# EAGLE design Blocky_Mini_Ultra (EAGLE 9.1.3)
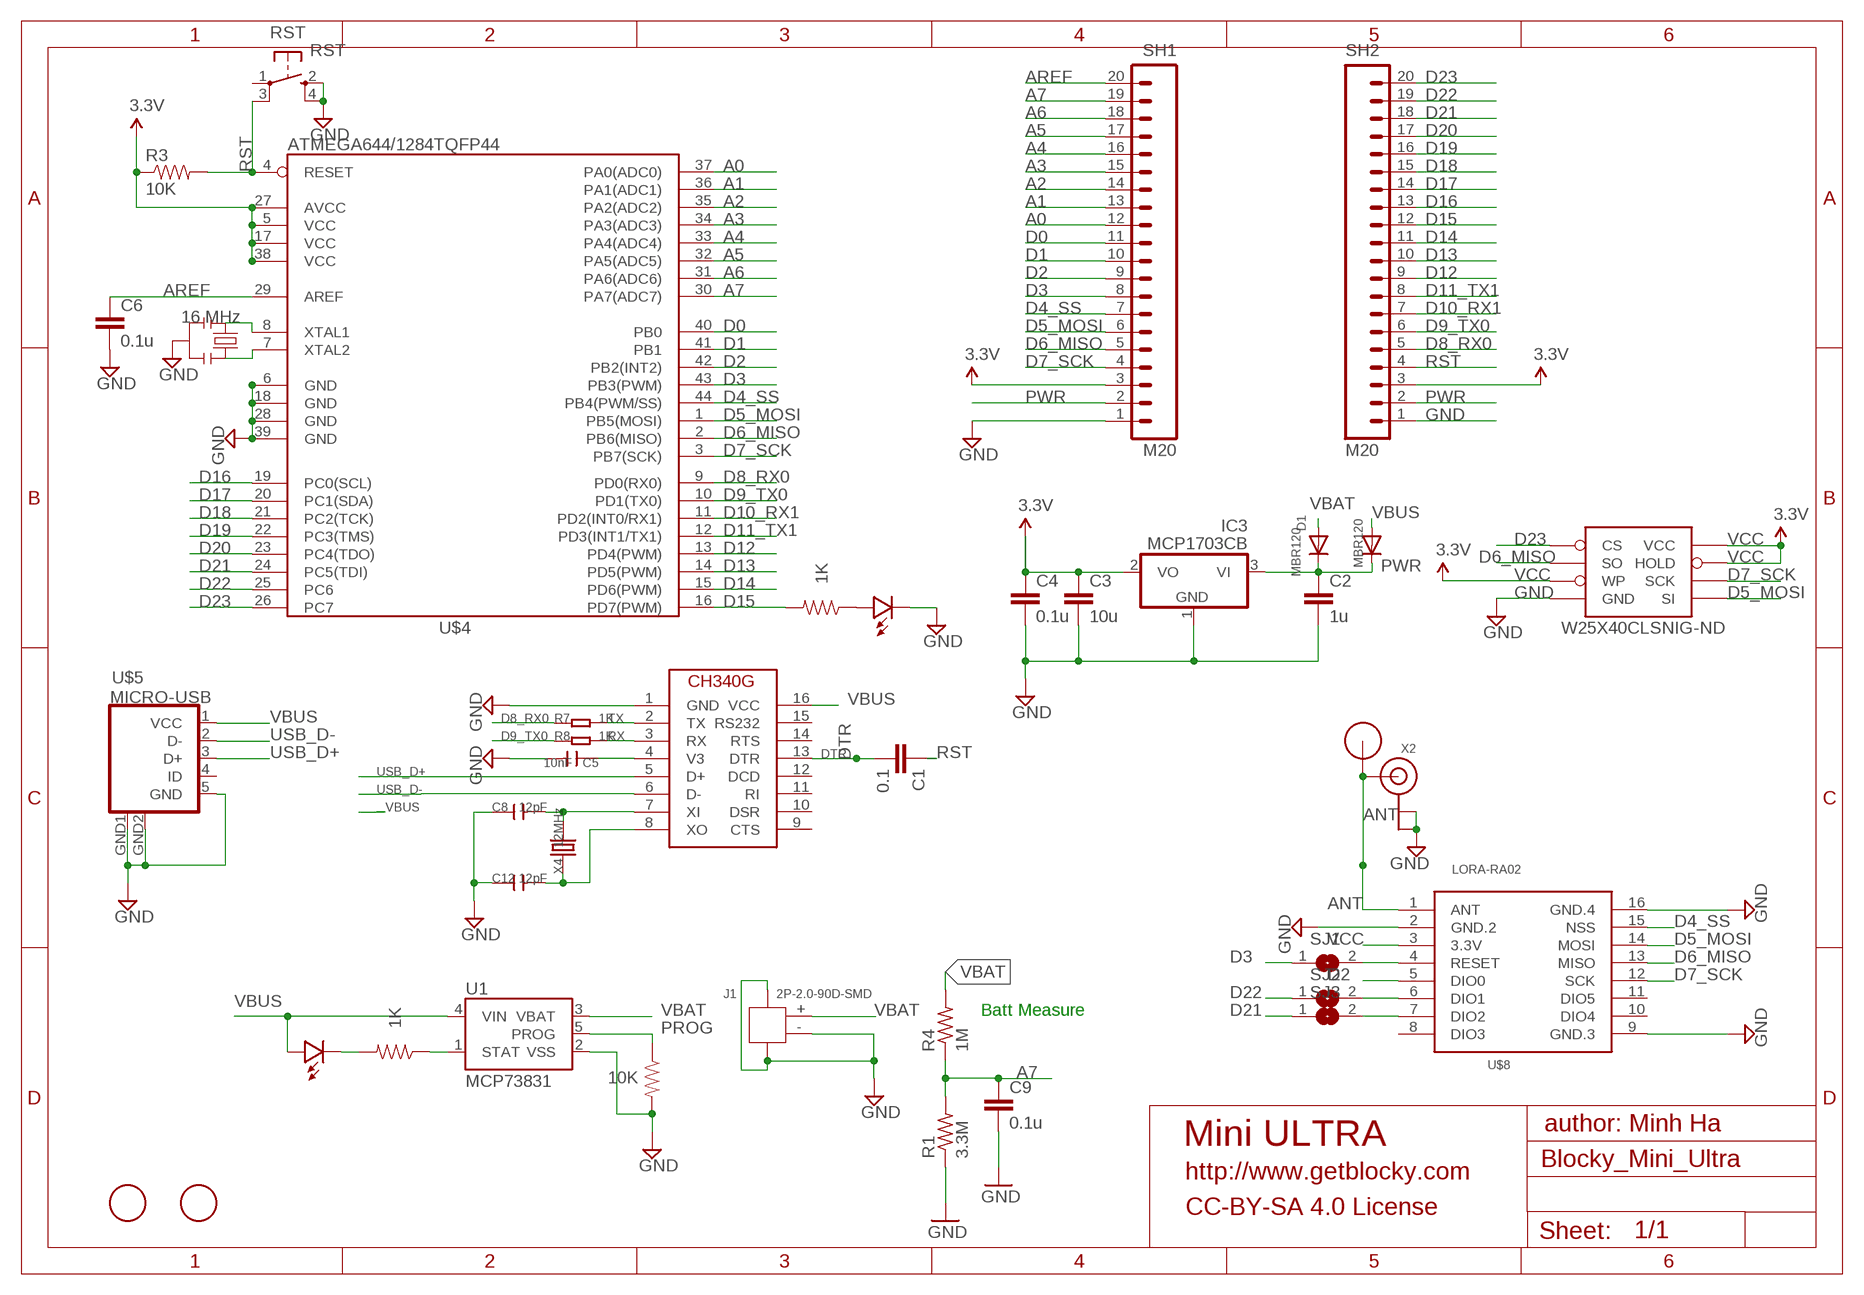
[diagram p0: schematic, sheet 1]

## Parts
C1  0.1  CAP0603-CAP  [0603-CAP]
C2  1u  CAP0603-CAP  [0603-CAP]
C3  10u  CAP0603-CAP  [0603-CAP]
C4  0.1u  CAP0603-CAP  [0603-CAP]
C5  10nF  C-0603  [C0603]
C6  0.1u  CAP0603-CAP  [0603-CAP]
C8  12pF  C-0603  [C0603]
C9  0.1u  CAP0603-CAP  [0603-CAP]
C12  12pF  C-0603  [C0603]
CHG  RED  LED0603  [0603-LED]
D1  MBR120  DIODESOD-123  [SOD-123]
IC3  MCP1703CB  [SOT23]
J1  2P-2.0-90D-SMD  CONN-HEADER-SMD-PH-SIDE-(2P-2.0MM)  [HW2-SMD-2.0-90D]
MBR0001  MBR120  DIODESOD-123  [SOD-123]
R1  3.3M  R-US_R0603  [R0603]
R2  1K  RESISTOR0603-RES  [0603-RES]
R3  10K  RESISTOR0603-RES  [0603-RES]
R4  1M  R-US_R0603  [R0603]
R5  1K  RESISTOR0603-RES  [0603-RES]
R6  10K  RESISTOR0603-RES  [0603-RES]
R7  1K  R-0603  [R0603]
R8  1K  R-0603  [R0603]
RST  RST  SPST_TACT-KMR2  [KMR2]
SH1  M20  [1X20]
SH2  M20  [1X20]
SJ1  SOLDERJUMPER  [SOLDERJUMPER_ARROW_NOPASTE]
SJ2  SOLDERJUMPER  [SOLDERJUMPER_ARROW_NOPASTE]
SJ3  SOLDERJUMPER  [SOLDERJUMPER_ARROW_NOPASTE]
U1  MCP73831  [SOT23-5]
U$1  RFM12B_ANTENNA  [RFM12B-ANTENNA]
U$2  FIDUCIAL  [FIDUCIAL_1MM]
U$4  ATMEGA644/1284TQFP44  [TQFP44]
U$5  MICRO-USB  [MICRO-USB]
U$6  LED0603  [0603-LED]
U$7  FIDUCIAL  [FIDUCIAL_1MM]
U$8  LORA-RA02  LORA-RA-02-433MHZ  [LORA-RA2-SMD]
U$9  CH340G  [SOIC16]
W25X40CLSNIG-ND  AT25F512BWIDE_5.3MM  [SO08WIDE]
X1  16 MHz  RESONATORSMD  [RESONATOR-SMD]
X2  ANTENNA_U.FL  [U.FL]
X4  12MHz  CRYSTAL'5032'  [2P-SMD-5X3.2]

## Nets
A0: SH1.12 U$4.37(PA0(ADC0))
A1: SH1.13 U$4.36(PA1(ADC1))
A2: SH1.14 U$4.35(PA2(ADC2))
A3: SH1.15 U$4.34(PA3(ADC3))
A4: SH1.16 U$4.33(PA4(ADC4))
A5: SH1.17 U$4.32(PA5(ADC5))
A6: SH1.18 U$4.31(PA6(ADC6))
A7: C9.1 R1.2 R4.1 SH1.19 U$4.30(PA7(ADC7))
ANT: U$1.P$1 U$8.1(ANT) X2.3(SIGNAL)
AREF: C6.1 SH1.20 U$4.29(AREF)
D0: SH1.11 U$4.40(PB0)
D1: SH1.10 U$4.41(PB1)
D2: SH1.9 U$4.42(PB2(INT2)) U$8.5(DIO0)
D3: SH1.8 SJ1.1 U$4.43(PB3(PWM))
D4_SS: SH1.7 U$4.44(PB4(PWM/SS)) U$8.15(NSS)
D5_MOSI: SH1.6 U$4.1(PB5(MOSI)) U$8.14(MOSI) W25X40CLSNIG-ND.5(SI)
D6_MISO: SH1.5 U$4.2(PB6(MISO)) U$8.13(MISO) W25X40CLSNIG-ND.2(SO)
D7_SCK: SH1.4 U$4.3(PB7(SCK)) U$8.12(SCK) W25X40CLSNIG-ND.6(SCK)
D8_RX0: R7.1 SH2.5 U$4.9(PD0(RX0))
D9_TX0: R8.1 SH2.6 U$4.10(PD1(TX0))
D10_RX1: SH2.7 U$4.11(PD2(INT0/RX1))
D11_TX1: SH2.8 U$4.12(PD3(INT1/TX1))
D12: SH2.9 U$4.13(PD4(PWM))
D13: SH2.10 U$4.14(PD5(PWM))
D14: SH2.11 U$4.15(PD6(PWM))
D15: R2.2 SH2.12 U$4.16(PD7(PWM))
D16: SH2.13 U$4.19(PC0(SCL))
D17: SH2.14 U$4.20(PC1(SDA))
D18: SH2.15 U$4.21(PC2(TCK))
D19: SH2.16 U$4.22(PC3(TMS))
D20: SH2.17 U$4.23(PC4(TDO))
D21: SH2.18 SJ3.1 U$4.24(PC5(TDI))
D22: SH2.19 SJ2.1 U$4.25(PC6)
D23: SH2.20 U$4.26(PC7) W25X40CLSNIG-ND.1(CS)
DIO1: SJ2.2 U$8.6(DIO1)
DIO2: SJ3.2 U$8.7(DIO2)
DTR: C1.2 U$9.13(DTR)
GND [power]: C2.2 C3.2 C4.2 C5.2 C6.2 C8.1 C9.2 C12.1 IC3.1(GND) J1.3 J1.4 J1.- R1.1 R6.2 RST.2(S) RST.4(S1) SH1.1 SH2.1 U1.2(VSS) U$4.6(GND) U$4.18(GND) U$4.28(GND) U$4.39(GND) U$5.5(GND) U$5.GND1(GND) U$5.GND2(GND) U$6.MINUS U$8.2(GND.2) U$8.9(GND.3) U$8.16(GND.4) U$9.1(GND) W25X40CLSNIG-ND.4(GND) X1.2 X2.1(GND) X2.2(GND)
N$1: U$4.8(XTAL1) X1.1
N$2: R2.1 U$6.PLUS
N$4: U$4.7(XTAL2) X1.3
N$9: CHG.MINUS R5.2
PROG: R6.1 U1.5(PROG)
PWR [power]: C2.1 D1.C IC3.3(VI) MBR0001.C SH1.2 SH2.2
RA02_RST: SJ1.2 U$8.4(RESET)
RST: C1.1 R3.2 RST.3(P1) SH2.4 U$4.4(RESET)
RX: R8.2 U$9.3(RX)
STAT: R5.1 U1.1(STAT)
TX: R7.2 U$9.2(TX)
USB_D+: U$5.3(D+) U$9.5(D+)
USB_D-: U$5.2(D-) U$9.6(D-)
V3: C5.1 U$9.4(V3)
VBAT: D1.A J1.+ R4.2 U1.3(VBAT)
VBUS: CHG.PLUS MBR0001.A U1.4(VIN) U$5.1(VCC) U$9.16(VCC)
VCC: C3.1 C4.1 IC3.2(VO) R3.1 SH1.3 SH2.3 U$4.5(VCC) U$4.17(VCC) U$4.27(AVCC) U$4.38(VCC) U$8.3(3.3V) W25X40CLSNIG-ND.3(WP) W25X40CLSNIG-ND.7(HOLD) W25X40CLSNIG-ND.8(VCC) ; supply symbol labelled 3.3V
XI: C8.2 U$9.7(XI) X4.2
XO: C12.2 U$9.8(XO) X4.1
Unconnected: RST.1(P) U$5.4(ID) U$8.8(DIO3) U$8.10(DIO4) U$8.11(DIO5) U$9.9(CTS) U$9.10(DSR) U$9.11(RI) U$9.12(DCD) U$9.14(RTS) U$9.15(RS232)

## Notes on the sheet
- Batt Measure
- author: Minh Ha
- Mini ULTRA
- http://www.getblocky.com
- CC-BY-SA 4.0 License

## Library data of the parts
C1-C4 C6 C9 = LowPowerLab:CAP: Capacitor Standard 0603 ceramic capacitor, and 0.1" leaded capacitor.
C5 C8 C12 = Discrete:C*: Ceramic Capacitors
CHG U$6 = LowPowerLab:LED
D1 MBR0001 = adafruit:DIODE: Diode SMADIODE - SMA Surface Mount Package 20V 1A Schottky Diode Digikey: 641-1014-6-ND DO-1N4148 - Through Hole Small Current Diode SOD-123 20V 1 A (.5mV Vf) Schottky Diode - Digikey: MBRX120TPMSCT-ND SOD-323 10V 570mA (.38mV Vf, 3ns) Schottky Diode - Digikey: ZLLS410CT-ND SOD-523 30V 30mA Schottky Diode (RB751S-40TE61) - Digikey: RB751S-40TE61CT-ND SOT23-R/W - SOT23 Package (R = Solder Paste/Reflow Ovens, W = Hand-Soldering) BAT54Film 40V 300mA - Digikey: 497-7162-1-ND
IC3 = linear:MCP1703: 250 mA, 16V, Low Quiescent Current LDO Regulator Source: http://ww1.microchip.com/downloads/en/DeviceDoc/22049b.pdf
J1 = Seeed-Connector:CONN-HEADER-SMD-PH-SIDE-(2P-2.0MM): 320110026
R1 R4 = adafruit:R-US_: RESISTOR, American symbol
R2 R3 R5 R6 = LowPowerLab:RESISTOR: Resistor Basic schematic elements and footprints for 0603, 1206, and PTH resistors.
R7 R8 = Discrete:R*
RST = adafruit:SPST_TACT: SMT 6mm switch, EVQQ2 series http://www.ladyada.net/library/eagle
SH1 SH2 = SparkFun-Connectors:M20: 1x20 .1" header This is just like the LOCK variant in that the holes are staggared by 5 mil, but except for the last two holes. They are not altered from the "standard" footprint layout. This is used for a special purpose on the layout of our Graphic LCD Backpack. Make sure you want to use this device before selecting it for you project!
SJ1-SJ3 = microbuilder:SOLDERJUMPER: SMD Solder JUMPER Solder the two pads together to create a connection, or remove the solder to break it. REFLOW - Use this footprint for solder paste and reflow ovens. WAVE - Use this footprint for hand-soldering (larger pads). CLOSED - Has a trace between the two pads to ensure it is closed by default. The trace needs to be cut to disable the jumper, and can be closed again by creating a solder bridge between the two pads.; BOM: EXCLUDE
U1 = SparkFun-PowerIC:MCP73831: Miniature single cell, fully integrated Li-Ion, Li-polymer charge management controller http://ww1.microchip.com/downloads/en/DeviceDoc/20001984g.pdf IC-09995; PROD_ID: IC-09995
U$1 = LowPowerLab:RFM12B_ANTENNA
U$2 U$7 = adafruit:FIDUCIAL: For use by pick and place machines to calibrate the vision/machine, 1mm By microbuilder.eu
U$4 = LowPowerLab:ATMEGA644/1284
U$5 = My-Eagle-Lib:MICRO-USB: Micro USB B connector
U$8 = LikeCircuit:LORA-RA-02-433MHZ: 433 MHz Lora Ra-02 Radio Transceiver Module based on SX1276 chip. Visit our more eagle PCB <https://www.likecircuit.com/>
U$9 = My-Eagle-Lib:CH340G
W25X40CLSNIG-ND = LowPowerLab:AT25F512B: 4-Mbit SPI flash memory
X1 = SparkFun:RESONATOR: Resonator Small SMD resonator. This is the itty bitty 10/20MHz resonators with built in caps. CSTCE10M0G55 and CSTCE20M0V53. Footprint has been reviewed closely but hasn't been tested yet.
X2 = adafruit:ANTENNA_U.FL: U.FL Antenna Connector
X4 = Discrete:CRYSTAL*: CRYSTAL

## Net classes
1 power: width 0.381 mm, clearance 0.254 mm
3 usbvcc: width 0.203 mm, drill 0.305 mm, clearance 0.203 mm

## Board
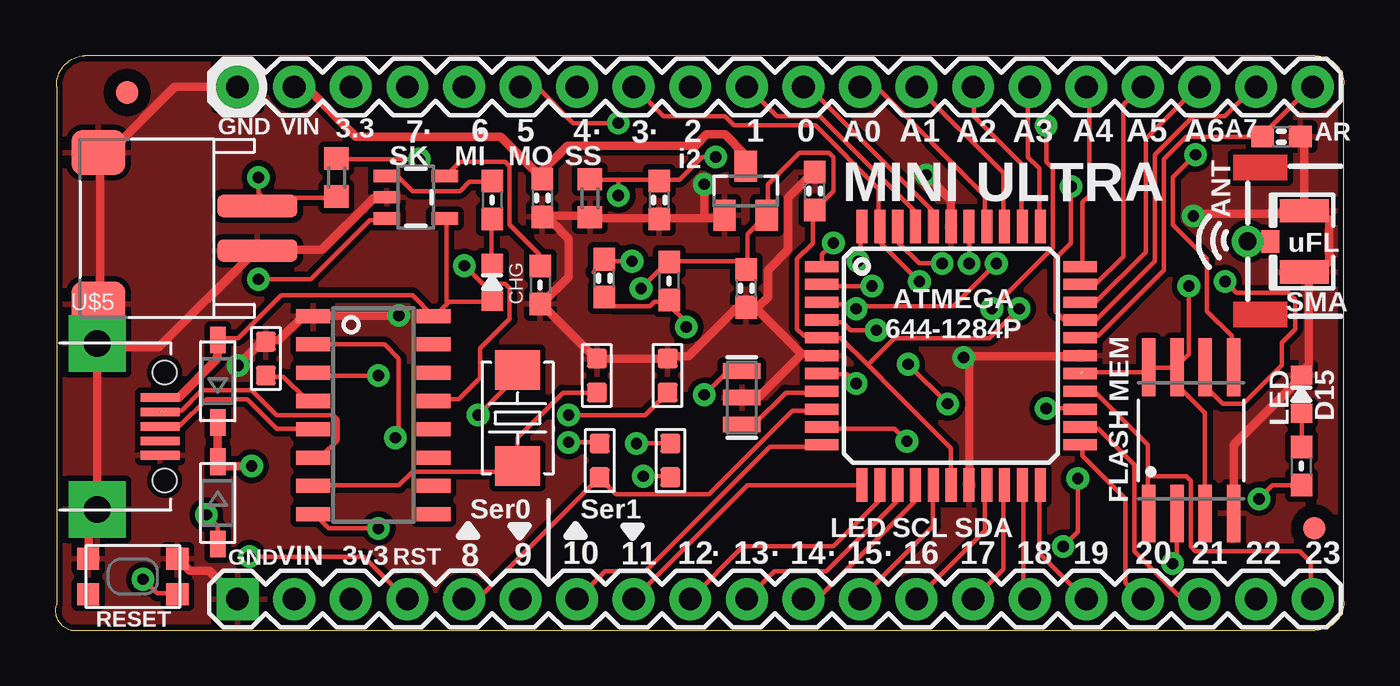
[diagram p1: board, top side]
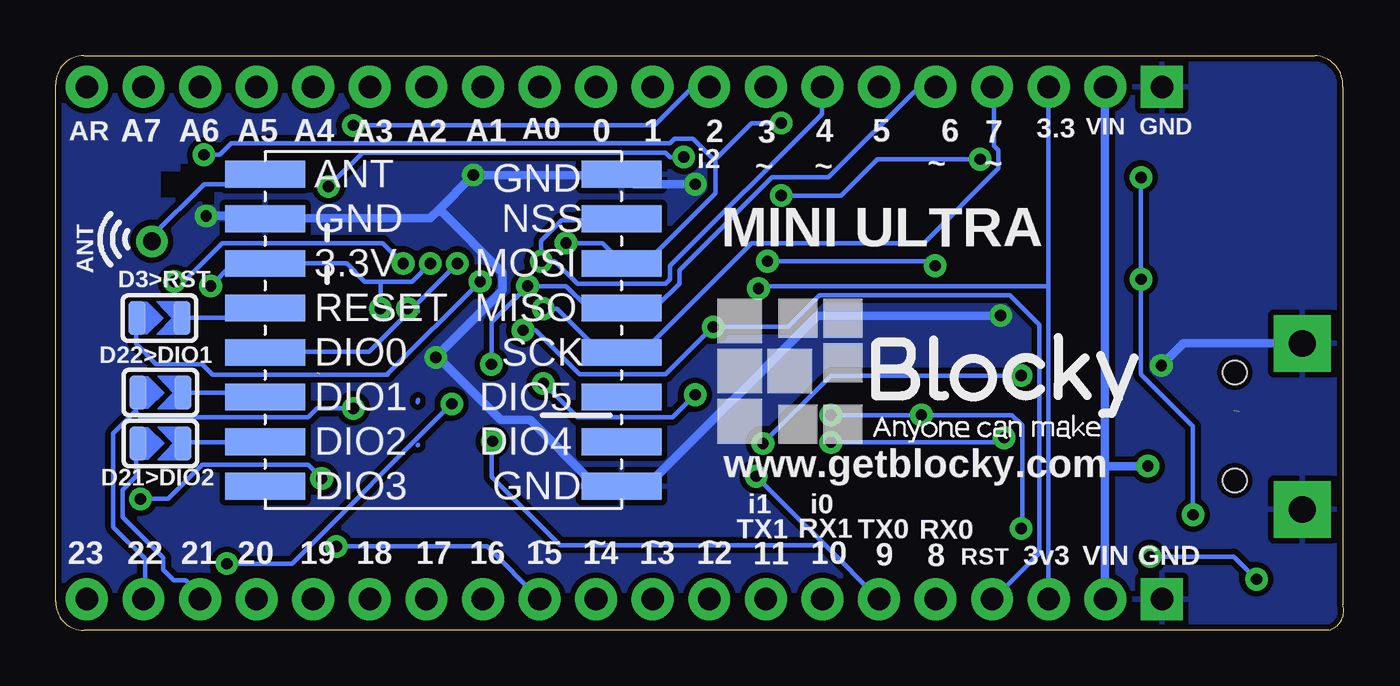
[diagram p2: board, bottom side, seen from below]

Size 57.82 x 25.78 mm. Coordinates in mm from the lower left corner, seen from the top.
Outline: 0.67,0 56.55,0 arc90 57.82,1.27 57.82,24.51 arc90 56.55,25.78 1.31,25.78 arc90 0.04,24.38 0.04,1.14 arc90 0.67,0
Copper layers (1*16): Top 0.035mm / dielectric 1.5mm / Bottom 0.035mm
Design rules "SparkFun": minimum track width 8mil, minimum drill 20mil, track to track 8mil, track to pad 8mil, pad to pad 8mil, via to via 8mil, smd to smd 8mil, copper to edge 10mil, drill to drill 8mil, minimum pad ring 12mil, minimum via ring 10mil, stop-mask expansion 4mil, vias tented up to drill 25mil, thermal gap 10mil
tRestrict: area 49.2,8.3 to 49.7,8.4
bRestrict: area 50.7,20.1 to 51.2,20.8; area 50.7,19.1 to 51.2,19.8; area 51.7,20.3 to 52.2,20.9; area 52.3,19.4 to 53.1,20.6

### Footprints (pad centres in the part's own frame; a part is rotated, then mirrored left to right if it is on the bottom)
0603-CAP = smd 1.016 x 0.965: 1 -0.85,0; 2 0.85,0
C0603 = smd 0.889 x 0.889: 1 -0.762,0; 2 0.762,0
0603-LED = smd 0.864 x 0.965: MINUS -0.85,0; PLUS 0.85,0
SOD-123 = smd 1.2 x 0.7: A 1.85,0; C -1.85,0
SOT23 = smd 1 x 1.4: 1 -0.95,-1.1; 2 0.95,-1.1; 3 0,1.1
HW2-SMD-2.0-90D = smd 2 x 2.4: 3 3.4,-2.181; 4 -3.4,-2.181 | smd 1 x 3.6: + -1,4.953; - 1,4.953
R0603 = smd 1 x 1.1: 1 -0.85,0; 2 0.85,0
0603-RES = smd 1.016 x 0.965: 1 -0.85,0; 2 0.85,0
R0603' = smd 0.889 x 0.889: 1 -0.762,0; 2 0.762,0
KMR2 = smd 1 x 1: 1 2,0.8; 2 2,-0.8; 3 -2,0.8; 4 -2,-0.8
1X20 = drill 1.016 pad 1.88 square: 1 0,0 | drill 1.016 pad 1.88: 2 2.54,0; 3 5.08,0; 4 7.62,0; 5 10.16,0; 6 12.7,0; 7 15.24,0; 8 17.78,0; 9 20.32,0; 10 22.86,0; 11 25.4,0; 12 27.94,0; 13 30.48,0; 14 33.02,0; 15 35.56,0; 16 38.1,0; 17 40.64,0; 18 43.18,0; 19 45.72,0; 20 48.26,0
SOLDERJUMPER_ARROW_NOPASTE = smd 0.762 x 1.524: 1 -1.016,0; 2 1.016,0
SOT23-5 = smd 0.55 x 1.2: 1 -0.95,-1.3; 2 0,-1.3; 3 0.95,-1.3; 4 0.95,1.3; 5 -0.95,1.3
RFM12B-ANTENNA = drill 0.8 pad 1.422: P$1 0,0
FIDUCIAL_1MM = smd 1 x 1: 1 0,0
TQFP44 = smd 1.5 x 0.5: 1 -5.8,4; 2 -5.8,3.2; 3 -5.8,2.4; 4 -5.8,1.6; 5 -5.8,0.8; 6 -5.8,0; 7 -5.8,-0.8; 8 -5.8,-1.6; 9 -5.8,-2.4; 10 -5.8,-3.2; 11 -5.8,-4; 23 5.8,-4; 24 5.8,-3.2; 25 5.8,-2.4; 26 5.8,-1.6; 27 5.8,-0.8; 28 5.8,0; 29 5.8,0.8; 30 5.8,1.6; 31 5.8,2.4; 32 5.8,3.2; 33 5.8,4 | smd 0.5 x 1.5: 12 -4,-5.8; 13 -3.2,-5.8; 14 -2.4,-5.8; 15 -1.6,-5.8; 16 -0.8,-5.8; 17 0,-5.8; 18 0.8,-5.8; 19 1.6,-5.8; 20 2.4,-5.8; 21 3.2,-5.8; 22 4,-5.8; 34 4,5.8; 35 3.2,5.8; 36 2.4,5.8; 37 1.6,5.8; 38 0.8,5.8; 39 0,5.8; 40 -0.8,5.8; 41 -1.6,5.8; 42 -2.4,5.8; 43 -3.2,5.8; 44 -4,5.8
MICRO-USB = smd 0.4 x 1.75: 1 -1.3,4.525; 2 -0.65,4.525; 3 0,4.525; 4 0.65,4.525; 5 1.3,4.525 | drill 1.2 pad 2.54 square: GND1 -3.725,1.7; GND2 3.725,1.7 | hole 1.05: -2.425,4.73; 2.425,4.73
LORA-RA2-SMD = smd 3.6 x 1.2: 1 -8,7; 2 -8,5; 3 -8,3; 4 -8,1; 5 -8,-1; 6 -8,-3; 7 -8,-5; 8 -8,-7; 9 8,-7; 10 8,-5; 11 8,-3; 12 8,-1; 13 8,1; 14 8,3; 15 8,5; 16 8,7
SOIC16 = smd 0.635 x 1.524: 1 -4.445,-2.695; 2 -3.175,-2.695; 3 -1.905,-2.695; 4 -0.635,-2.695; 5 0.635,-2.695; 6 1.905,-2.695; 7 3.175,-2.695; 8 4.445,-2.695; 9 4.445,2.695; 10 3.175,2.695; 11 1.905,2.695; 12 0.635,2.695; 13 -0.635,2.695; 14 -1.905,2.695; 15 -3.175,2.695; 16 -4.445,2.695
SO08WIDE = smd 0.61 x 2.6: 1 -1.905,-3.269; 2 -0.635,-3.269; 3 0.635,-3.269; 4 1.905,-3.269; 5 1.905,3.286; 6 0.635,3.286; 7 -0.635,3.286; 8 -1.905,3.286
RESONATOR-SMD = smd 0.7 x 1.7: 1 -1.2,0; 2 0,0; 3 1.2,0
U.FL = smd 2.2 x 1.05: 1 0,1.375; 2 0,-1.375 | smd 0.8 x 1: 3 1.525,0
2P-SMD-5X3.2 = smd 1.778 x 2.032: 1 -2.159,0; 2 2.159,0

### Placement (x,y rotation side)
C1  24.62,15.8 90 top
C2  21.84,19.4 270 top
C3  30.99,15.35 270 top
C4  34.07,19.71 90 top
C5  9.43,12.19 90 top
C6  55.02,22.15 0 top
C8  24.29,11.43 270 top
C9  27.09,19.3 270 top
C12  27.47,11.43 270 top
CHG  19.59,15.62 270 top
D1  7.27,5.71 270 top
IC3  30.97,19.72 0 top
J1  4.1,18.03 270 top
MBR0001  7.27,11.18 90 top
R1  23.98,19.38 90 top
R2  55.92,7.37 270 top
R3  27.53,15.67 270 top
R4  12.61,20.32 270 top
R5  19.59,19.3 270 top
R6  21.75,15.49 270 top
R7  1K  [R0603']  24.42,7.62 90 top
R8  1K  [R0603']  27.59,7.62 90 top
RST  3.46,2.41 180 top
SH1  8.16,24.38 0 top
SH2  8.16,1.4 0 top
SJ1  53.17,14.01 0 bottom
SJ2  53.12,10.67 0 bottom
SJ3  53.12,8.38 0 bottom
U1  16.16,19.43 270 top
U$1  53.5,17.45 0 top
U$2  56.51,4.58 0 top
U$3  [BLOCKY_LOGO]  29.12,8.13 0 bottom
U$4  40.19,12.32 0 top
U$5  0.16,9.14 270 top
U$6  55.92,10.59 270 top
U$7  3.21,24.13 0 top
U$8  40.42,13.46 0 bottom
U$9  14.26,9.65 270 top
W25X40CLSNIG-ND  50.96,8.51 0 top
X1  30.79,10.44 90 top
X2  56.04,17.45 180 top
X4  20.74,9.52 270 top

### Tracks (layer width: path | path; a pad name or v marks a point on that pad's centre or on a via)
A0
  Top 0.203: U$4.37 41.72,18.19 41.72,19.51 36.84,24.38 36.13,24.38 SH1.12
A1
  Top 0.203: U$4.36 42.53,18.19 42.53,20.52 38.67,24.38 SH1.13
A2
  Top 0.203: U$4.35 43.34,18.19 43.34,20.93 41.21,23.06 41.21,24.38 SH1.14
A3
  Top 0.203: U$4.34 44.16,18.19 44.16,20.73 43.65,21.23 43.65,24.38 SH1.15
A4
  Top 0.203: U$4.33 46.09,16.36 46.09,19.2 46.39,19.51 46.39,24.28 46.29,24.38 SH1.16
A5
  Top 0.203: U$4.32 46.09,15.54 46.7,15.54 47.91,16.76 47.91,23.57 48.73,24.38 SH1.17
A6
  Top 0.203: U$4.31 46.09,14.73 46.7,14.73 48.93,16.97 48.93,22.05 51.27,24.38 SH1.18
A7  (via drill 0.51)
  Top 0.203: 25.26,20.22 24.04,20.22 R1.2 | 25.26,20.22 27.09,20.22 | 27.09,20.22 C9.1 | v16.32,21.13 12.66,21.13 R4.1 | 25.26,20.22 v25.26,19.51 | SH1.19 53.81,24.38 52.49,23.06 51.06,23.06 49.34,21.34 49.34,16.56 46.7,13.92 46.09,13.92 U$4.30 45.27,13.92 44.87,14.33 44.87,16.66 45.58,17.37 v45.58,19.91 | 27.09,20.22 28,20.22 29.02,21.23 v29.63,21.23
  Bottom 0.203: v16.32,21.13 20.94,21.13 22.57,19.51 v25.26,19.51 | v29.63,21.23 30.24,21.23 30.44,21.44 44.05,21.44 v45.58,19.91
ANT
  Top 0.203: X2.3 54.42,17.48 53.5,17.48 U$1.P$1
  Bottom 0.203: U$1.P$1 53.5,17.48 53.5,17.68 51.17,20.02 48.83,20.02 48.42,20.42 U$8.1
AREF
  Top 0.203: SH1.20 56.35,24.38 54.42,22.45 54.27,22.25 C6.1 50.76,22.15 49.74,21.13 49.74,16.15 46.8,13.21 46.09,13.21 U$4.29
D0
  Top 0.203: U$4.40 39.38,18.19 39.38,18.8 33.79,24.38 33.59,24.38 SH1.11
D1
  Top 0.203: U$4.41 38.57,18.19 38.57,18.8 34.3,23.06 32.37,23.06 31.05,24.38 SH1.10
D2  (via drill 0.51)
  Top 0.203: v39.79,16.46 38.77,16.46 37.86,17.37 37.86,18.09 U$4.42 | v44.46,22.66 44.46,21.03 44.76,20.73 44.76,17.17 v42.02,14.43
  Bottom 0.203: 41.87,14.38 43.75,12.5 48.32,12.5 U$8.5 | 41.87,14.38 v39.79,16.46 | v44.46,22.66 30.95,22.66 29.22,24.38 28.51,24.38 SH1.9 | v42.02,14.43 41.92,14.43 41.87,14.38
D3  (via drill 0.51)
  Top 0.203: SH1.8 25.97,24.38 27.29,23.06 30.03,23.06 30.44,22.66 34.1,22.66 36.94,19.81 36.94,18.19 U$4.43 37.04,18.09 37.04,17.37 v38.77,15.65
  Bottom 0.203: v38.77,15.65 42.91,11.5 42.91,11.47 50.77,11.47 51.24,11.94 53.3,11.94 54.21,12.85 54.21,13.92 SJ1.1
D4_SS  (via drill 0.51)
  Top 0.203: v36.03,16.56 36.13,16.66 36.13,18.09 U$4.44
  Bottom 0.203: U$8.15 32.47,18.39 35.11,18.39 36.03,17.48 v36.03,16.56 35.42,16.56 34.4,15.54 30.44,15.54 30.24,15.75 30.24,16.36 23.43,23.17 23.43,24.38 SH1.7
D5_MOSI  (via drill 0.51)
  Top 0.203: v34.91,17.37 34.4,16.87 34.4,16.36 U$4.1 | v51.17,21.34 50.15,20.32 50.15,18.19 51.67,16.66 51.67,14.33 52.79,13.21 52.79,11.89 W25X40CLSNIG-ND.5 | v25.26,22.76 23.23,22.76 21.6,24.38 20.89,24.38 SH1.6
  Bottom 0.203: v34.91,17.37 33.28,17.37 32.47,16.56 U$8.14 32.37,16.56 31.25,16.56 28.2,19.61 28.2,21.03 28.25,21.08 | v51.17,21.34 50.45,21.34 49.95,21.84 30.24,21.84 30.03,22.05 29.22,22.05 28.25,21.08 | v25.26,22.76 26.58,22.76 28.2,21.13 28.25,21.08
D6_MISO  (via drill 0.51)
  Top 0.203: v36.64,15.44 34.4,15.44 U$4.2 | W25X40CLSNIG-ND.2 50.33,3.17 v50.14,2.99 | v38.26,11.94 v40.04,10.16
  Bottom 0.203: SH1.5 18.35,24.38 19.06,24.38 23.12,20.32 25.66,20.32 29.83,16.15 29.83,15.54 30.85,14.53 32.37,14.53 U$8.13 32.47,14.53 34,14.53 34.91,15.44 v36.64,15.44 38.26,13.82 v38.26,11.94 | v50.14,2.99 47.21,2.99 v40.04,10.16
D7_SCK  (via drill 0.51)
  Top 0.203: U$4.3 34.4,14.63 35.72,14.63 v35.93,14.43 35.93,14.53 40.29,14.53 v42.22,16.46 | v52.49,15.65 52.99,15.14 55.33,15.14 55.64,14.83 55.64,13.51 55.03,12.9 55.03,11.89 53.3,10.16 52.38,10.16 51.67,10.87 51.67,11.68 W25X40CLSNIG-ND.6
  Bottom 0.203: v35.93,14.43 35.32,14.43 33.39,12.5 32.47,12.5 U$8.12 32.37,12.5 31.46,12.5 26.58,17.37 18.86,17.37 15.5,20.73 15.5,21.54 15.71,21.74 15.71,24.38 SH1.4 | v52.49,15.65 52.08,15.65 50.35,17.37 43.14,17.37 v42.22,16.46
D8_RX0
  Top 0.203: U$4.9 34.3,9.85 33.08,9.85 29.32,6.1 25.16,6.1 24.44,6.81 R7.1 24.34,6.81 18.93,1.4 SH2.5
D9_TX0  (via drill 0.51)
  Top 0.203: v26.38,6.91 27.59,6.91 R8.1 | v38.21,8.48 37.65,9.04 34.4,9.04 U$4.10
  Bottom 0.203: 23.28,3.81 20.89,1.42 SH2.6 | 23.28,3.81 24.93,5.46 v26.38,6.91 | 23.28,3.81 35.18,3.81 38.25,6.89 38.25,8.44 v38.21,8.48
D10_RX1
  Top 0.203: U$4.11 34.3,8.23 32.06,8.23 26.48,2.64 24.65,2.64 23.43,1.42 SH2.7
D11_TX1
  Top 0.203: U$4.12 36.13,6.5 31.05,6.5 25.97,1.42 SH2.8
D12
  Top 0.203: U$4.13 36.94,6.5 36.94,5.79 34.91,3.76 30.85,3.76 28.51,1.42 SH2.9
D13
  Top 0.203: U$4.14 37.75,6.5 37.75,5.79 34.6,2.64 32.27,2.64 31.05,1.42 SH2.10
D14
  Top 0.203: U$4.15 38.57,6.5 38.57,5.79 34.2,1.42 33.59,1.42 SH2.11
D15  (via drill 0.51)
  Top 0.203: v54.01,5.89 54.62,6.5 55.84,6.5 R2.2 | v45.88,6.81 45.88,4.42 v45.22,3.76 | U$4.16 39.38,6.5 39.38,4.67 36.13,1.42 SH2.12
  Bottom 0.203: v45.88,6.81 46.49,7.42 51.25,7.42 52.77,5.89 v54.01,5.89 | v45.22,3.76 38.47,3.76 36.13,1.42 SH2.12
D16
  Top 0.203: U$4.19 41.72,6.5 41.72,4.47 38.67,1.42 SH2.13
D17
  Top 0.203: U$4.20 42.53,6.5 42.53,2.74 41.21,1.42 SH2.14
D18
  Top 0.203: U$4.21 43.44,6.5 43.44,1.63 43.65,1.42 SH2.15
D19
  Top 0.203: U$4.22 44.16,6.5 44.16,3.45 46.19,1.42 SH2.16
D20
  Top 0.203: U$4.23 46.09,8.23 46.09,7.82 48.02,5.89 48.02,2.13 48.73,1.42 SH2.17
D21
  Top 0.203: U$4.24 46.09,9.04 46.8,9.04 48.42,7.42 48.42,3.56 50.56,1.42 51.27,1.42 SH2.18
  Bottom 0.203: SJ3.1 54.21,8.33 54.21,6.91 54.82,6.3 54.82,5.08 52.99,3.25 52.99,2.71 52.52,2.24 51.98,2.24 51.36,1.61 51.36,1.51 SH2.18
D22  (via drill 0.51)
  Top 0.203: v44.46,9.96 45.98,9.96 U$4.25
  Bottom 0.203: SH2.19 53.81,1.42 53.81,3.2 55.23,4.62 55.23,8.84 54.26,9.8 | 54.26,9.8 54.21,9.85 54.21,10.67 SJ2.1 | v44.46,9.96 46.09,9.96 46.49,9.55 54.01,9.55 54.21,9.75 54.26,9.8
D23
  Top 0.203: 49.03,6.91 49.03,5.28 W25X40CLSNIG-ND.1 | 49.03,6.91 49.03,8.33 46.7,10.67 46.09,10.67 U$4.26 | 49.03,6.91 50.76,6.91 50.96,6.71 50.96,3.76 51.17,3.56 53.3,3.56 55.84,3.56 56.35,3.05 56.35,1.42 SH2.20
DIO1
  Bottom 0.203: 41.56,10.24 41.56,10.33 | 49.44,10.36 49.74,10.67 52.08,10.67 SJ2.2
DIO2
  Bottom 0.203: 41.56,8.31 41.56,8.33 | 49.95,8.43 52.08,8.43 SJ3.2
DTR  (via drill 0.51)
  Top 0.203: v25.87,16.56 24.65,16.56 C1.2 | v18.35,16.36 19.16,15.54 20.18,15.54 20.38,15.34 20.38,13.97 19.06,12.65 19.06,11.33 18.09,10.36 17.03,10.36 U$9.13
  Bottom 0.203: v25.87,16.56 18.55,16.56 v18.35,16.36
GND  (via drill 0.51)
  Top 0.381: 2.4,5.79 1.94,5.33 | 1.94,5.33 1.48,4.88 1.48,3.25 RST.2 | U1.2 14.79,19.41 14.28,19.41 11.95,17.07 9.1,17.07 J1.- 8.9,16.97 4.63,12.7 2.03,12.7 U$5.GND1 | v8.19,11.89 9.1,12.8 9.31,12.8 C5.2 9.51,13 10.02,13 11.03,14.02 11.54,14.02 U$9.1 11.74,14.12 v15.4,14.12 | 2.4,12.6 1.99,13 U$5.GND1 | J1.3 1.99,14.73 1.99,21.34 J1.4 2.09,21.44 2.4,21.44 5.34,24.38 8.09,24.38 SH1.1 | U$4.18 41.01,6.6 41.01,11.99 v40.75,12.24 40.8,12.29 45.98,12.29 U$4.28 | 31.46,14.43 31.05,14.43 C3.2 30.85,14.43 30.54,14.43 28.41,12.29 27.59,12.29 C12.1 27.39,12.19 24.34,12.19 C8.1 24.14,12.29 21.8,14.63 R6.2 21.9,14.73 23.02,15.85 23.02,17.58 22.29,18.31 | 33.49,12.39 31.46,14.43 | 33.49,12.39 34.3,12.39 U$4.6 | C4.2 34,20.52 32.88,19.41 32.88,17.07 31.96,16.15 31.96,14.93 31.56,14.53 31.46,14.43 | X1.2 30.85,10.46 31.56,10.46 33.39,12.29 33.49,12.39 | 22.29,18.31 C2.2 | 29.12,18.49 29.83,18.49 29.93,18.59 IC3.1 | 29.12,18.49 27.09,18.49 C9.2 26.98,18.49 24.14,18.49 R1.1 23.94,18.59 22.72,18.59 22.01,18.59 22.29,18.31 | C6.2 56.04,21.91 56.04,18.9 X2.2 | W25X40CLSNIG-ND.4 52.89,5.28 52.89,8.33 55.84,11.28 U$6.MINUS 56.25,11.95 56.25,15.85 56.04,16.05 X2.1 56.35,15.75 57.16,16.56 57.16,18.39 56.86,18.69 56.14,18.69 X2.2 | v39.08,20.42 40.19,19.3 40.19,18.19 U$4.39 | v51.06,18.59 51.17,18.69 55.94,18.69 X2.2 | v29.12,20.02 29.12,18.59 29.12,18.49 | SH2.1 6.89,2.67 6.01,2.67 RST.4 | U$5.GND1 1.86,5.41 | 1.86,5.41 1.94,5.33 | U$5.GND2 1.86,5.41
  Bottom 0.381: 32.47,6.5 U$8.9 | 40.6,18.9 39.18,20.32 v39.08,20.42 32.47,20.42 U$8.16 32.27,20.42 31.86,20.02 v29.12,20.02 | 40.6,18.9 41.01,18.49 48.32,18.49 U$8.2 48.52,18.59 v51.06,18.59 | 40.6,18.9 40.5,18.8 37.75,16.05 37.75,15.27 40.72,12.3 40.8,12.29 v40.75,12.24 40.6,12.19 37.86,9.45 36.54,9.45 33.69,6.6 U$8.9 | v15.4,14.12 23.63,14.12 31.25,6.5 32.27,6.5 U$8.9 | U$5.GND1 7.21,12.87 v8.19,11.89
  pour Top: 57.82,25.91 57.82,0 0.16,0 0.16,25.91
  pour Bottom: 0.16,25.91 0.16,0 57.82,0 57.82,25.91
N$1
  Top 0.203: U$4.8 34.3,10.67 32.78,10.67 31.35,9.25 30.85,9.25 X1.1
N$2
  Top 0.203: U$6.PLUS 55.94,9.65 55.94,8.23 R2.1
N$4  (via drill 0.51)
  Top 0.203: v35.93,11.07 35.52,11.48 34.4,11.48 U$4.7 | v29.12,10.57 30.13,11.58 30.74,11.58 X1.3
  Bottom 0.203: v35.93,11.07 34.4,9.55 30.13,9.55 v29.12,10.57
N$9
  Top 0.203: CHG.MINUS 19.57,16.56 19.57,18.39 R5.2
PROG
  Top 0.203: R6.1 21.7,16.36 21.7,16.87 20.38,18.19 20.38,20.83 20.18,21.03 18.15,21.03 17.54,20.42 U1.5
PWR  (via drill 0.51)
  Top 0.381: MBR0001.C 7.27,9.25 7.27,7.62 D1.C 7.38,7.42 7.43,7.37 v8.8,7.37 | IC3.3 30.95,20.83 30.95,21.34 30.03,22.25 29.22,22.25 28.71,21.74 22.97,21.74 21.84,20.61 C2.1 21.84,20.29 19.97,22.15 13.47,22.15 11.24,24.38 10.73,24.38 SH1.2
  Bottom 0.381: 10.73,7.37 10.73,24.38 SH1.2 | 10.73,7.37 10.73,1.42 SH2.2 | 10.73,7.37 v8.8,7.37
RA02_RST
  Bottom 0.203: 41.56,14.3 41.56,14.33 | 49.34,14.43 49.74,14.02 52.08,14.02 SJ1.2
RST  (via drill 0.51)
  Top 0.203: C1.1 24.65,14.93 25.05,14.53 26.68,14.53 26.88,14.73 27.49,14.73 R3.2 27.49,14.63 28.31,13.82 v28.31,13.61 | v36.84,13.46 35.67,13.46 35.32,13.82 34.4,13.82 U$4.4 | SH2.4 15.71,1.42 13.83,3.3 v8.7,3.3 | RST.3 5.43,1.65 4.56,1.65 v3.92,2.29
  Bottom 0.203: v36.84,13.46 36.28,13.46 34.3,11.48 30.44,11.48 v28.31,13.61 24.95,13.61 23.53,15.04 15,15.04 13.68,13.72 13.68,3.45 15.71,1.42 SH2.4 | v3.92,2.29 4.94,3.3 v8.7,3.3
RX  (via drill 0.51)
  Top 0.203: U$9.3 11.69,11.43 v14.49,11.43 | v26.07,8.38 R8.2
  Bottom 0.203: v14.49,11.43 23.02,11.43 v26.07,8.38
STAT
  Top 0.203: R5.1 19.57,20.12 18.55,20.12 18.15,19.71 16.01,19.71 15.4,20.32 14.89,20.32 U1.1
TX  (via drill 0.51)
  Top 0.203: v23.02,8.43 24.34,8.43 R7.2 | U$9.2 13.62,12.83 14.77,12.83 15.4,12.19 15.4,8.79 v15.25,8.64
  Bottom 0.203: v23.02,8.43 15.45,8.43 v15.25,8.64
USB_D+
  Top 0.203: 4.94,9.14 5.55,9.14 6.77,10.36 8.6,10.36 9.92,9.04 11.54,9.04 U$9.5
  Top 0.381: U$5.3 4.94,9.14
USB_D-  (1 unrouted)
  Top 0.203: 4.94,9.85 5.65,9.85 6.56,10.77 8.8,10.77 9.92,9.65 12.46,9.65 12.66,9.45 12.66,8.53 11.95,7.82 11.64,7.82 U$9.6
V3
  Top 0.203: C5.1 9.51,11.38 10.22,11.38 11.24,10.36 11.54,10.36 U$9.4
VBAT  (via drill 0.51)
  Top 0.203: R4.2 12.56,19.41 9.41,19.41 9.1,19.1 J1.+ 9.31,19.41 9.1,19.61 v9.1,20.32 | v6.77,5.18 7.27,4.67 7.27,3.96 D1.A | v9.1,15.75 11.44,15.75 14.08,18.39 14.79,18.39 U1.3
  Bottom 0.203: v6.77,5.18 6.77,9.14 9.1,11.48 v9.1,15.75 v9.1,20.32
VBUS
  Top 0.203: 7.27,12.8 7.27,13 MBR0001.A 7.27,13.11 8.19,13.11 10.12,15.04 16.01,15.04 16.93,14.12 U$9.16 17.03,14.12 17.59,14.68 | 17.59,14.68 17.64,14.73 19.57,14.73 CHG.PLUS | U1.4 17.54,18.39 17.54,14.73 17.59,14.68
  Top 0.381: 4.94,10.46 4.92,10.44 U$5.1 5.53,10.44 7.24,12.15 | 7.24,12.15 7.24,12.19 | 7.24,12.15 7.24,12.28 7.27,12.32 7.27,12.8
VCC  (via drill 0.51)  (1 unrouted)
  Top 0.203: 24.19,16.13 24.13,16.07 | v41.01,16.46 41.01,18.09 U$4.38 | W25X40CLSNIG-ND.7 50.25,11.79 49.13,11.79 W25X40CLSNIG-ND.8 49.03,11.79 48.83,11.58 46.09,11.58 | W25X40CLSNIG-ND.3 51.57,5.28 51.57,9.75 50.25,11.07 50.25,11.68 W25X40CLSNIG-ND.7 | v50.86,15.44 50.86,12.39 50.35,11.89 W25X40CLSNIG-ND.7 | 36.46,11.91 37.73,10.64 40.17,8.2 40.19,8.17 U$4.17 | v26.27,15.34 27.49,16.56 R3.1 27.59,16.56 31.05,16.56 31.05,17.78 31.86,18.59 IC3.2 31.96,18.69 31.96,20.02 33.39,21.44 34.71,21.44 34.91,21.23 34.91,19.71 34.1,18.9 C4.1 34,18.8 34,17.37 33.28,16.66 33.28,13.51 33.59,13.21 34.3,13.21 U$4.5 34.4,13.11 35.26,13.11 36.46,11.91 | v43.24,14.43 41.92,13.11 37.65,13.11 36.48,11.94 36.46,11.91
  Bottom 0.203: 13.27,15.44 13.27,24.38 SH1.3 | 13.27,15.44 13.27,1.42 SH2.3 | v41.01,16.46 41.82,15.65 43.24,15.65 | 43.24,15.65 43.95,15.65 44.76,16.46 48.32,16.46 U$8.3 49.84,16.46 v50.86,15.44 | 13.27,15.44 22.51,15.44 26.17,15.44 v26.27,15.34 | v43.24,14.43 43.24,15.65
XI
  Top 0.203: U$9.7 11.64,6.5 15.4,6.5 16.01,7.11 20.48,7.11 20.69,7.32 X4.2 20.74,8.64 22.77,10.67 C8.2
XO  (via drill 0.51)
  Top 0.203: v14.49,4.57 12.25,4.57 11.64,5.18 U$9.8 | 20.69,11.68 X4.1 20.74,11.43 v18.96,9.65 | v23.02,9.65 26.45,9.65 C12.2
  Bottom 0.203: v14.49,4.57 14.44,4.62 14.44,9.19 14.89,9.65 v18.96,9.65 v23.02,9.65
(copper drawn outside any net)
  shapes: Top area x2

### Text on the board
tPlace: ANT | MINI ULTRA | uFL | SMA
bPlace: MINI ULTRA
tDocu: REG
_tsilk: VIN | 3.3 | 7 | . | . | 6 | 5 | 4 | . | 3 | . | 2 | 1 | 0 | A1 | A2 | A3 | A4 | A5 | A6 | A7 | GND | A0 | AR | SK | MI | MO | SS | i2 | ATMEGA / 644-1284P | LED | D15 | MEM | Ser0 | Ser1 | FLASH | VIN | 3v3 | RST | 8 | 9 | 10 | 11 | 12 | . | 13 | . | 14 | LED | . | 15 | SCL | . | 16 | SDA | 17 | 18 | 19 | 20 | 21 | 22 | 23 | GND | RESET
_bsilk: VIN | 3.3 | 7 | 6 | 5 | 4 | 3 | 2 | 1 | 0 | A1 | A2 | A3 | A4 | A5 | A6 | A7 | GND | ~ | ~ | A0 | AR | ~ | ~ | i2 | ANT | D3>RST | D22>DIO1 | D21>DIO2 | RX0 | RX1 | i0 | i1 | ~ | ~ | ~ | ~ | VIN | 3v3 | RST | 8 | 9 | TX0 | 10 | 11 | TX1 | 12 | 13 | 14 | 15 | 16 | 17 | 18 | 19 | 20 | 21 | 22 | 23 | GND